# EasyEDA Pro project ProPrj_Ozealis_2025-07-08.epro, board PCB1
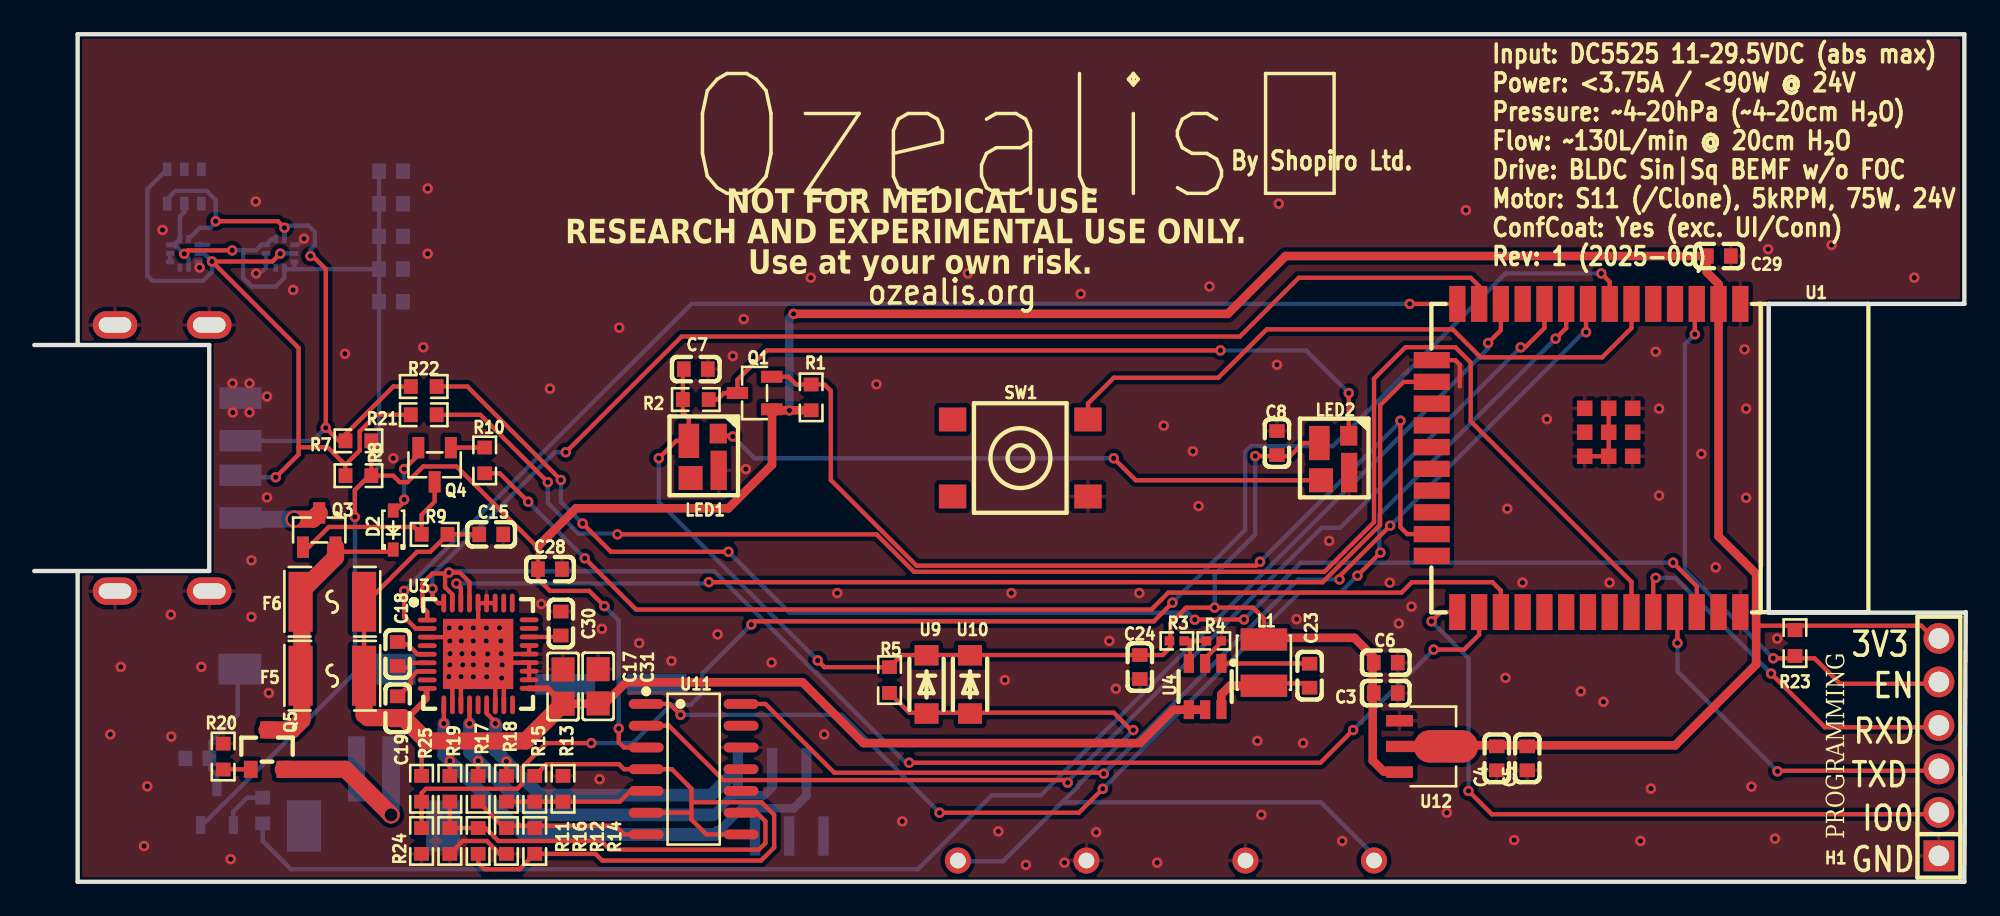
[diagram p1: board, top side]
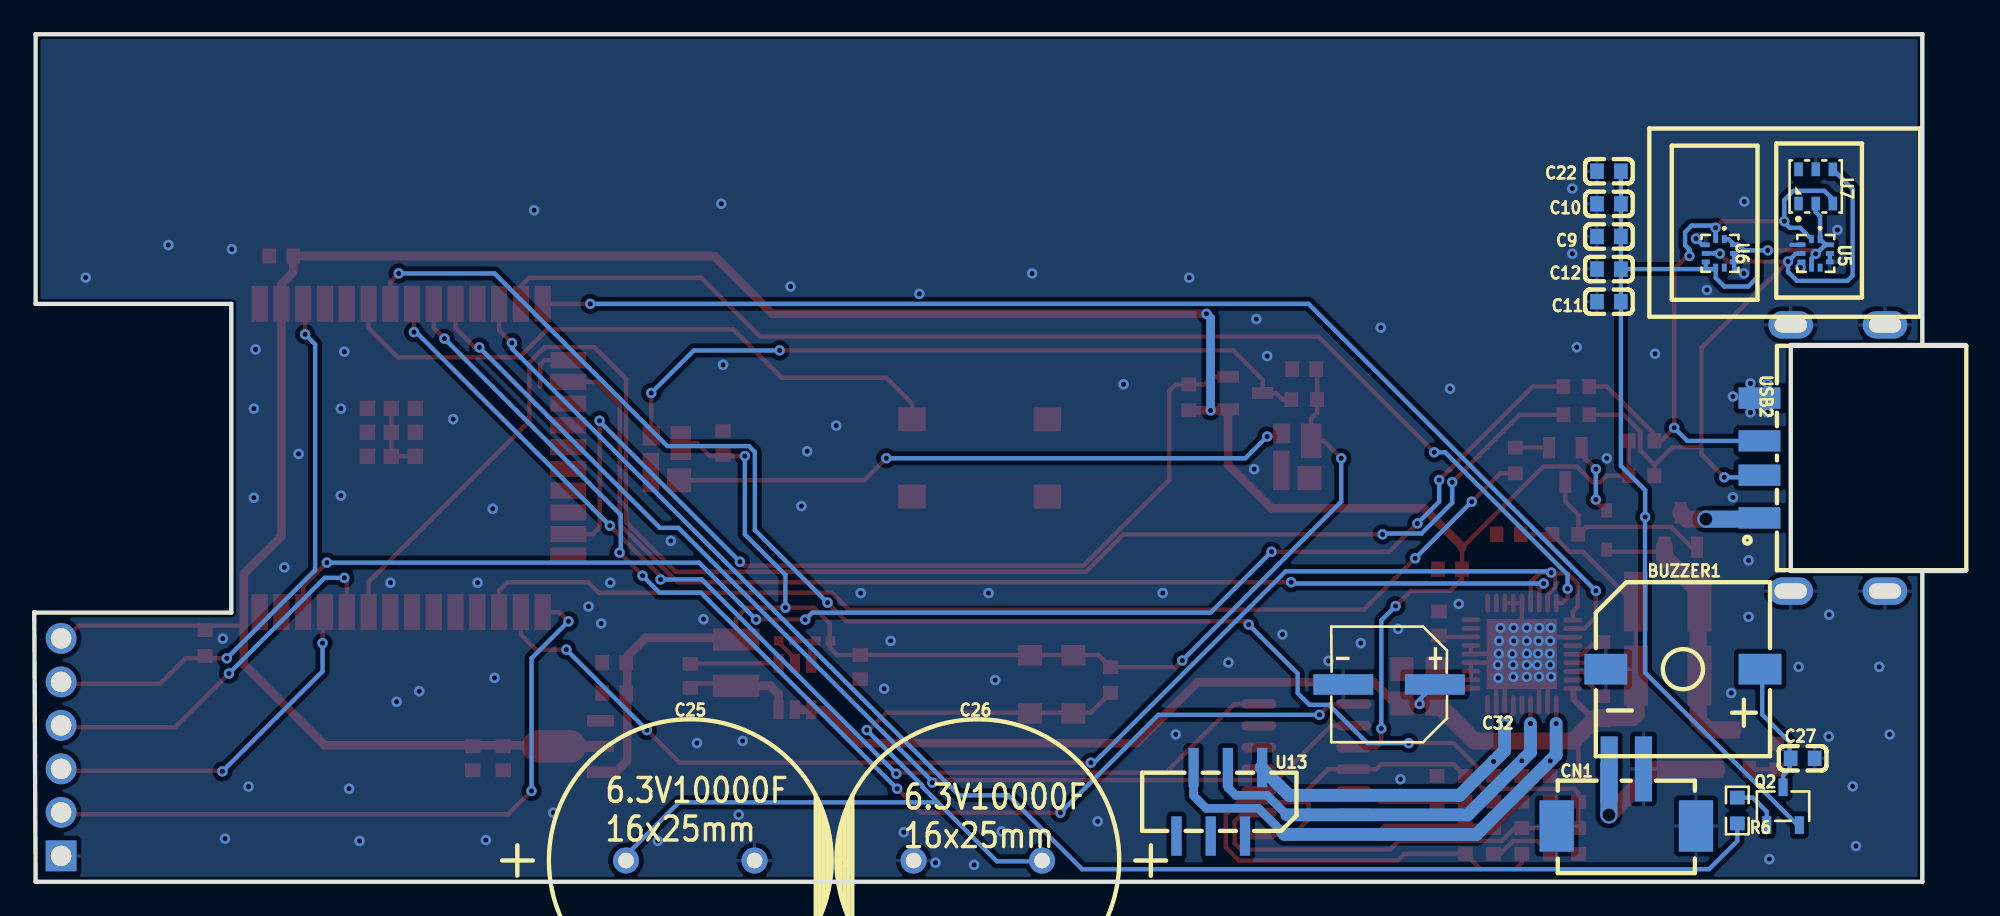
[diagram p2: board, bottom side, seen from below]

Outline 112.7 x 49.5 mm; copper layers: Top Layer, Bottom Layer. Coordinates in mm from the lower left corner of the outline.
Outline path: 2.53,31.38 2.53,49.5 112.62,49.5 112.62,33.75 101.2,33.75 101.2,15.72 112.66,15.72 112.7,15.75 112.62,0 2.53,0 2.53,18.14
Stack: Top Layer 0.035mm / Dielectric1 1.51mm FR4 er 4.5 / Bottom Layer 0.035mm

## Design rules (mm)
template: JLCPCB Capability(Two Layers Board)
spacing copperThickness1oz (default): track to track 0.102, other pairs 0.152 to 0.3
spacing copperThickness2oz: track to track 0.203, other pairs 0.152 to 0.3
track width copperThickness1oz (default): min 0.127, default 0.254, max 2.54
track width copperThickness2oz: min 0.203, default 0.254, max 2.54
differential pair differentialPair (default): width min 0.127, default 0.254, max 2.54; gap min 0.152, default 0.152
via viaSize (default): diameter min 0.5, default 0.61, max 10; hole min 0.3, default 0.305, max 6.3

## Placement (name value [footprint] x y rotation side)
BUZZER1  3kHz  [BUZ-SMD_L9.6-W9.6-LS10.0-R]  16.5 12.42 180 bottom
C3  100nF  [C0603]  78.86 11.02 180 top
C4  100nF  [C0603]  85.34 7.21 270 top
C5  1uF  [C0603]  87.11 7.21 270 top
C6  1uF  [C0603]  78.86 12.8 180 top
C7  100nF  [C0603]  38.6 29.94 0 top
C8  100nF  [C0603]  72.51 25.62 90 top
C9  100nF  [C0603]  20.82 37.69 180 bottom
C10  1uF  [C0603]  20.82 39.59 0 bottom
C11  100nF  [C0603]  20.82 33.88 180 bottom
C12  1uF  [C0603]  20.82 35.78 0 bottom
C15  100nF  [C0603]  26.66 20.29 0 top
C17  10uF  [C0805]  30.85 11.4 270 top
C18  100nF  [C0603]  21.2 13.31 90 top
C19  10nF  [C0603]  21.2 10.13 90 top
C22  100nF  [C0603]  20.82 41.5 0 bottom
C23  100nF  [C0603]  74.41 12.03 270 top
C24  10uF  [C0603]  64.51 12.54 270 top
C25  6.3V10000uF  [PolCap_16x25mm]  74.41 1.24 0 bottom
C26  6.3V10000uF  [PolCap_16x25mm]  57.65 1.24 180 bottom
C27  100nF  [C0603]  9.52 7.21 0 bottom
C28  100nF  [C0603]  30.09 18.26 0 top
C29  1uF  [C0603]  98.29 36.55 0 top
C30  470nF  [C0603]  30.73 15.08 90 top
C31  10uF  [C0805]  32.9 11.42 270 top
C32  100uF  [CAP-SMD_BD6.3-L6.6-W6.6-LS7.4-FD]  33.65 11.53 0 bottom
CN1  HCZZ0469-2  [CONN-SMD_2P-P2.00_HCZZ0469-2]  19.8 4.92 180 bottom
D2  BZT52C10S  [SOD-323_L1.7-W1.3-LS2.6-RD]  20.95 20.54 90 top
F5  SMD1812-200C-30V  [F1812]  17.39 12.03 0 top
F6  SMD1812-200C-30V  [F1812]  17.39 16.35 0 top
H1  2.54-1x6P直针  [HDR-TH_6P-P2.54-V-M-1]  111.13 7.86 90 top
L1  3.3uH  [IND-SMD_L3.0-W3.0_FNR30XXS]  71.75 12.8 270 top
LED1  SK6812MINI-B-012  [LED-SMD_4P-L3.5-W3.5-R-SK6812MINI]  39.06 24.88 90 top
LED2  SK6812MINI-B-012  [LED-SMD_4P-L3.5-W3.5-R-SK6812MINI]  75.85 24.75 90 top
Q1  BSS138  [SOT-23-3_L2.9-W1.3-P1.90-LS2.4-BR-1]  42.03 28.55 0 top
Q2  IRLML6344  [SOT-23-3_L3.0-W1.7-P0.95-LS2.9-BR]  10.66 4.42 270 bottom
Q3  CJ2305  [SOT-23-3_L2.9-W1.3-P1.90-LS2.4-BR]  16.63 20.54 270 top
Q4  MMBT3904(RANGE:100-300)  [SOT-23-3_L2.9-W1.3-P1.90-LS2.4-BR]  23.36 24.35 90 top
Q5  AO3401A  [SOT-23_L2.9-W1.3-P1.90-LS2.4-BR]  13.58 7.72 270 top
R1  10kΩ  [R0603]  45.33 28.29 90 top
R2  10kΩ  [R0603]  38.6 28.16 0 top
R3  118kΩ  [R0402]  66.67 14.07 0 top
R4  22.1kΩ  [R0402]  68.83 14.07 180 top
R5  2.2Ω  [R0603]  49.9 11.78 270 top
R6  10kΩ  [R0603]  13.33 4.16 90 bottom
R7  10kΩ  [R0603]  18.91 25.75 180 top
R8  10kΩ  [R0603]  18.91 23.72 180 top
R9  10kΩ  [R0603]  23.36 20.29 0 top
R10  1kΩ  [R0603]  26.28 24.61 270 top
R11  10kΩ  [R0603]  24.25 2.38 270 top
R12  10kΩ  [R0603]  27.55 2.38 270 top
R13  10kΩ  [R0603]  30.85 5.43 90 top
R14  100kΩ  [R0603]  29.2 2.38 90 top
R15  100kΩ  [R0603]  29.2 5.43 270 top
R16  100kΩ  [R0603]  25.9 2.38 90 top
R17  100kΩ  [R0603]  25.9 5.43 90 top
R18  100kΩ  [R0603]  27.55 5.43 90 top
R19  100kΩ  [R0603]  24.25 5.43 90 top
R20  10kΩ  [R0603]  11.02 7.31 90 top
R21  100Ω  [R0603]  22.72 27.28 180 top
R22  100Ω  [R0603]  22.72 28.93 180 top
R23  10kΩ  [R0603]  102.73 13.94 270 top
R24  10kΩ  [R0603]  22.6 2.38 90 top
R25  100kΩ  [R0603]  22.6 5.43 90 top
SW1  B3FS-1000P  [KEY-SMD_4P-L6.0-W6.3-P4.50-LS8.0]  57.53 24.75 0 top
U1  ESP32-WROOM-32E-N8  [WIFI-SMD_ESP32-WROOM-32E]  90.54 24.75 180 top
U3  DRV8313RHHR  [VQFN-36_L6.0-W6.0-P0.50-TL-EP]  25.9 13.31 0 top
U4  LMR54406DBVR  [SOT-23-6_L2.9-W1.6-P0.95-LS2.8-BR]  68.32 11.4 90 top
U5  LPS22HBTR  [HLGA-10L_LPS22HBTR]  8.75 36.7 270 bottom
U6  LPS22HBTR  [HLGA-10L_LPS22HBTR]  14.34 36.7 270 bottom
U7  AHT20  [SENSOR-SMD_L3.0-W3.0-P1.00-BR]  8.75 40.61 270 bottom
U9  SD103AWL  [SOD-123FL_L2.8-W1.9-LS3.7-RD]  52.06 11.53 270 top
U10  SD103AWL  [SOD-123FL_L2.8-W1.9-LS3.7-RD]  54.6 11.53 270 top
U11  LM339  [SOIC-14_L8.7-W3.9-P1.27-LS6.0-BL]  38.47 6.57 270 top
U12  AMS1117-3.3(XBLW) SOT-89  [SOT-89-3_L4.5-W2.5-P1.50-LS4.2-BR]  81.01 7.9 180 top
U13  AFB10-S06LCA-00  [FPC-SMD_6P-P1.00_AFB10-S6LCA-00]  43.55 4.67 0 bottom
USB2  U-A-24DS-W-1  [USB-A-SMD_U-A-24DS-W-1.]  8.37 24.75 90 bottom

## Footprints (pads in the part's own frame, mm; a bottom-side part is the same pattern mirrored in y, then rotated)
BUZ-SMD_L9.6-W9.6-LS10.0-R
  rect 2.5x1.8 smd: 1(4.5,0) 2(-4.5,0)
C0603
  rect 0.8x0.9 smd: 1(-0.7,0) 2(0.7,0)
C0805
  rect 1.41x1.35 smd: 1(-1,0) 2(1,0)
CAP-SMD_BD6.3-L6.6-W6.6-LS7.4-FD
  rect 3.5x1.2 smd: 1(-2.67,0) 2(2.67,0)
CONN-SMD_2P-P2.00_HCZZ0469-2
  rect 1x3.8 smd: 1(1,1.667) 2(-1,1.667)
  rect 2x3 smd: 3(-4.064,-1.667) 4(4.064,-1.667)
F1812
  rect 1.407x3.499 smd: 1(-1.853,0) 2(1.853,0)
FPC-SMD_6P-P1.00_AFB10-S6LCA-00
  rect 0.6x2.3 smd: 1(-2.5,-2) 2(-1.5,2) 3(-0.5,-2) 4(0.5,2) 5(1.5,-2) 6(2.5,2)
HDR-TH_6P-P2.54-V-M-1
  rect 1.8x1.8 hole 1.2: 1(-6.35,0)
  round 1.8 hole 1.2: 2(-3.81,0) 3(-1.27,0) 4(1.27,0) 5(3.81,0) 6(6.35,0)
HLGA-10L_LPS22HBTR
  rect 0.465x0.28 smd: 1(-0.833,0.255) 2(-0.833,-0.245) 6(0.833,-0.245) 7(0.833,0.255)
  rect 0.28x0.465 smd: 3(-0.5,-0.828) 4(0,-0.828) 5(0.5,-0.828) 8(0.5,0.828) 9(0,0.828) 10(-0.5,0.828)
IND-SMD_L3.0-W3.0_FNR30XXS
  rect 1.3x2.72 smd: 1(1.35,0) 2(-1.35,0)
KEY-SMD_4P-L6.0-W6.3-P4.50-LS8.0
  rect 1.6x1.4 smd: 1(3.95,-2.25) 2(-3.95,-2.25) 3(3.95,2.25) 4(-3.95,2.25)
LED-SMD_4P-L3.5-W3.5-R-SK6812MINI
  rect 1.15x1 smd: 1(1.3,-0.845)
  rect 2x1.2 smd: 2(0.875,0.87)
  rect 1.4x1.4 smd: 3(-1.3,0.77)
  rect 2.3x0.95 smd: 4(-0.85,-0.87)
PolCap_16x25mm
  round 1.524 hole 0.914: 1(3.757,-0.001) 2(-3.743,-0.001)
R0402
  rect 0.566x0.54 smd: 1(-0.433,0) 2(0.433,0)
R0603
  rect 0.806x0.864 smd: 1(-0.753,0) 2(0.753,0)
SENSOR-SMD_L3.0-W3.0-P1.00-BR
  rect 0.8x0.5 smd: 1(1,-1) 2(1,0) 3(1,1) 4(-1,1) 5(-1,0) 6(-1,-1)
SOD-123FL_L2.8-W1.9-LS3.7-RD
  rect 1.2x1.4 smd: 1(-1.7,0) 2(1.7,0)
SOD-323_L1.7-W1.3-LS2.6-RD
  rect 0.83x0.63 smd: 1(-1.14,0) 2(1.14,0)
SOIC-14_L8.7-W3.9-P1.27-LS6.0-BL
  oval 0.574x2.038 smd: 1(-3.81,-2.769) 2(-2.54,-2.769) 3(-1.27,-2.769) 4(0,-2.769) 5(1.27,-2.769) 6(2.54,-2.769) 7(3.81,-2.769) 8(3.81,2.769) 9(2.54,2.769) 10(1.27,2.769) 11(0,2.769) 12(-1.27,2.769) 13(-2.54,2.769) 14(-3.81,2.769)
SOT-23-3_L2.9-W1.3-P1.90-LS2.4-BR
  rect 1.25x0.7 smd: 1(1,-0.95) 2(1,0.95) 3(-1,0)
SOT-23-3_L2.9-W1.3-P1.90-LS2.4-BR-1
  rect 1.25x0.7 smd: 1(1,-0.95) 2(1,0.95) 3(-1,0)
SOT-23-3_L3.0-W1.7-P0.95-LS2.9-BR
  rect 1.038x0.532 smd: 1(1.101,-0.95) 2(1.101,0.95) 3(-1.101,0)
SOT-23-6_L2.9-W1.6-P0.95-LS2.8-BR
  rect 1.1x0.6 smd: 1(1.35,-0.95) 2(1.35,0) 3(1.35,0.95) 4(-1.35,0.95) 5(-1.35,0) 6(-1.35,-0.95)
SOT-23_L2.9-W1.3-P1.90-LS2.4-BR
  rect 1x0.8 smd: 1(1.15,-0.95) 2(1.15,0.95) 3(-1.15,0)
SOT-89-3_L4.5-W2.5-P1.50-LS4.2-BR
  rect 1.575x0.672 smd: 1(1.356,-1.5) 3(1.356,1.5)
  custom 5.377x1.9 smd: 2(-1.356,0)
USB-A-SMD_U-A-24DS-W-1.
  rect 1.25x2.45 smd: 1(-3.5,3.663) 2(-1,3.663) 3(1,3.663) 4(3.5,3.663)
  oval 1.6x2.6 hole 0.9x1.9: 5(-7.775,-3.663) 5(-7.775,1.837) 5(7.775,-3.663) 5(7.775,1.837)
VQFN-36_L6.0-W6.0-P0.50-TL-EP
  oval 1.1x0.28 smd: 1(-2.972,1.981) 2(-2.972,1.484) 3(-2.972,0.983) 4(-2.972,0.482) 5(-2.972,-0.018) 6(-2.972,-0.518) 7(-2.972,-1.018) 8(-2.972,-1.519) 9(-2.972,-2.017) 19(2.972,-2.006) 20(2.972,-1.509) 21(2.972,-1.008) 22(2.972,-0.508) 23(2.972,-0.007) 24(2.972,0.493) 25(2.972,0.993) 26(2.972,1.494) 27(2.972,1.992)
  oval 0.28x1.1 smd: 10(-2.002,-2.972) 11(-1.504,-2.972) 12(-1.004,-2.972) 13(-0.503,-2.972) 14(-0.003,-2.972) 15(0.498,-2.972) 16(0.998,-2.972) 17(1.498,-2.972) 18(2.006,-2.972) 28(1.992,2.972) 29(1.494,2.972) 30(0.993,2.972) 31(0.493,2.972) 32(-0.007,2.972) 33(-0.508,2.972) 34(-1.008,2.972) 35(-1.509,2.972) 36(-2.006,2.972)
  rect 4.1x4.1 smd: 37(0,0)
WIFI-SMD_ESP32-WROOM-32E
  rect 0.95x2.1 smd: 1(-9.002,-9) 2(-7.732,-9) 3(-6.463,-9) 4(-5.192,-9) 5(-3.922,-9) 6(-2.652,-9) 7(-1.383,-9) 8(-0.113,-9) 9(1.157,-9) 10(2.428,-9) 11(3.697,-9) 12(4.968,-9) 13(6.237,-9) 14(7.508,-9) 25(7.508,9) 26(6.237,9) 27(4.968,9) 28(3.697,9) 29(2.428,9) 30(1.157,9) 31(-0.113,9) 32(-1.383,9) 33(-2.652,9) 34(-3.922,9) 35(-5.192,9) 36(-6.463,9) 37(-7.732,9) 38(-9.002,9)
  rect 2.1x0.95 smd: 15(9.002,-5.715) 16(9.002,-4.445) 17(9.002,-3.175) 18(9.002,-1.905) 19(9.002,-0.635) 20(9.002,0.635) 21(9.002,1.905) 22(9.002,3.175) 23(9.002,4.445) 24(9.002,5.715)
  rect 0.9x0.9 smd: 39(-2.721,-0.1) 39(-2.721,-1.5) 39(-2.721,-2.9) 39(-1.321,-0.1) 39(-1.321,-1.5) 39(-1.321,-2.9) 39(0.079,-0.1) 39(0.079,-1.5) 39(0.079,-2.9)

## Nets
As in the schematic.

Pads without a net: LED1 3; SW1 2 4; U1 4 5 11 17 18 19 20 21 22 24 28 29 30 31 32 37; U3 4 8 14 18 26 27 28 29; U5 7; U6 7; U7 1 6; U11 10 11 13; U13 2 4 6

## Via types
v1: diameter 0.61, hole 0.305, Top Layer to Bottom Layer, 202 vias
v2: diameter 1, hole 0.75, Top Layer to Bottom Layer, 2 vias

## Routing (per net, layer and track width the routed paths; a pad name or vN(x,y) marks a point on that pad's centre or on a via; arc(x,y) is an arc through that point)
3V3: length 235.2
  Top Layer w0.254: 100.47,15.04 100.55,14.96 110.1,14.96 110.96,14.1 ; v1(18.71,21.31) 18.71,22.88 19.55,23.72 R8.1 ; R8.1 R7.1 ; R8.1 20.95,23.72 21.33,23.34 21.77,23.34 22.69,24.26 24.64,24.26 29.39,19.51 C28.1 29.39,17.69 30.09,16.99 32.38,16.99 v1(33.27,16.1) ; U11.3 34.41,7.84 34.1,8.15 v1(34.1,8.95) ; v1(8.75,36.67) 8.96,36.88 v1(11.55,36.88)
  Top Layer w0.5: R1.1 43.3,27.54 43.04,27.28 43.04,24.35 40.5,21.81 31.61,21.81 29.39,19.59 29.39,19.51 ; 82.17,7.97 95.75,7.97 100.47,12.69 100.47,17.98 98.27,20.18 U1.2 98.27,34.91 97.59,35.59 C29.1 73.02,36.55 69.64,33.17 v1(44.3,33.17)
  Bottom Layer w0.254: U6.5 15.17,35.79 15.16,35.78 ; C12.1 C11.2 20.12,24.29 18.71,22.88 v1(18.71,21.31) 18.71,21.3 18.71,12.22 9.77,3.27 9.6,3.27 ; C12.1 15.52,35.78 15.52,35.78 15.16,35.78 ; C12.1 C9.2 C10.1 C22.1 ; v1(33.27,16.1) 34.1,15.26 v1(34.1,8.95) ; 8.71,36.69 9,36.39 U5.6 ; 8.71,36.69 8.27,37.12 8.25,37.12 8.17,37.2 ; 8.71,36.69 8.74,36.69 v1(8.75,36.67) ; 15.16,35.78 14.82,35.78 14.82,35.78 14.67,35.78 U6.6 14.59,35.27 14.09,34.77 12.69,34.77 12.18,35.28 12.18,36.88 ; 8.17,37.2 U5.1 8.5,38.86 8.75,39.12 U7.2 ; 8.17,37.2 U5.10 ; v1(11.55,36.88) 12.18,36.88 ; 12.18,36.88 12.92,36.88 13.25,37.2 U6.10 13.85,37.53 U6.1
  Bottom Layer w0.5: v1(44.06,27.53) 44.06,32.93 v1(44.3,33.17)
5V: length 81
  Top Layer w0.254: 71.75,14.15 71.75,15.38 71.11,16.01 v1(68.87,16.01) 67.21,16.01 67.17,15.97 ; v1(36.44,24.73) 37.46,25.75 LED1.2 38.19,27.05 37.85,27.39 37.85,27.94 ; v1(71.24,24.86) 73.27,24.86 74.03,25.62 LED2.2 ; 67.17,15.97 67.15,15.97 ; 67.17,15.97 66.28,15.08 66.28,13.69 65.84,13.24 C24.1 50.61,13.24 R5.1 46.1,12.53 v1(45.71,12.92) ; C7.1 37.85,29.89 R2.1
  Top Layer w0.5: 80.12,6.45 78.73,6.45 78.1,7.08 78.1,13.18 77.03,14.25 71.85,14.25 71.75,14.15
  Bottom Layer w0.254: v1(71.24,24.86) 71.24,20.29 68.87,17.92 v1(68.87,16.01) ; v1(45.71,12.92) 36.44,22.19 v1(36.44,24.73)
GND: length 38
  Top Layer w0.254: U3.37 v1(26.46,13.31) 28.36,13.31 ; U3.37 25.9,16.27 U3.32 U3.31 U3.30 ; U3.37 26.41,12.8 28.87,12.8 U3.21 U3.20 ; U3.37 24.92,14.29 U3.3 ; 24.4,11.67 24.4,11.77 v1(24.19,11.98) ; 24.4,11.67 24.9,12.17 24.9,10.33 ; 24.4,11.67 24.4,10.33 ; R11.2 25,2.38 26.41,2.38 27.16,1.63 R12.2 ; 83.18,28.93 83.18,30.2 82.91,30.47 U1.15 ; U1.39 U1.39 U1.39 U1.39 ; 26.9,12.31 26.9,10.33 ; U3.24 U3.23 ; 27.4,11.81 27.4,10.33 ; R4.1 69.26,13.99 68.32,13.04 U4.2
  Bottom Layer w0.254: U6.9 U6.8 13.51,35.85 13.33,35.66 ; v1(15.74,37.56) 15.38,37.2 U6.3 ; U5.9 U5.8 ; U5.3 10.17,37.2
  vias: v1(4.44,8.61) v1(5.05,12.55) v1(6.41,2.09) v1(6.59,5.57) v1(7.48,38.07) v1(7.97,15.6) v1(7.99,8.48) v1(9.65,35.87) v1(9.75,12.55) v1(11.46,1.32) v1(11.57,29.1) v1(11.58,27.41) v1(12.56,29.11) v1(12.56,27.41) v1(12.67,18.77) v1(12.67,15.47) v1(12.92,39.73) v1(12.95,35.53) v1(13.58,28.34) v1(13.58,22.45) v1(13.68,11.03) v1(15.1,34.56) v1(18.13,30.84) v1(20.95,24.73) v1(22.7,31.22) v1(22.96,40.49) v1(22.96,36.68) v1(24.21,14.83) v1(24.25,14.07) v1(24.26,13.32) v1(24.25,12.67) v1(24.88,14.83) v1(24.92,14.07) v1(24.96,13.32) v1(24.9,11.98) v1(25,12.67) v1(25.62,14.83) v1(25.62,14.07) v1(25.62,13.32) v1(25.62,12.67) v1(25.62,11.97) v1(26.38,14.83) v1(26.37,14.07) v1(26.41,12.67) v1(26.39,11.97) v1(27.15,14.83) v1(27.23,14.07) v1(27.24,13.32) v1(27.27,11.9) v1(27.3,12.67) v1(29.58,16.23) v1(30.09,28.8) v1(32.98,5.99) v1(33.12,14.77) v1(34.13,32.36) v1(35.3,13.94) v1(37.18,12.9) v1(39.87,14.45) v1(40.76,30.7) v1(41.39,32.86) v1(41.52,24.1) v1(43.02,12.8) v1(45.31,35.28) v1(46.09,8.61) v1(46.85,16.86) v1(49.14,29.05) v1(50.65,3.53) v1(54.47,35.53) v1(56.25,2.94) v1(56.63,11.78) v1(57.01,16.86) v1(57.86,0.99) v1(60.11,1.11) v1(61.06,34.34) v1(61.96,2.89) v1(62.73,14.07) v1(63.11,11.27) v1(64.48,16.86) v1(65.52,1.11) v1(65.9,26.64) v1(67.6,25.14) v1(67.94,21.94) v1(68.57,34.77) v1(71.37,8.22) v1(71.6,3.91) v1(72.51,30.2) v1(72.61,39.6) v1(73.65,15.34) v1(74.03,8.1) v1(75.56,19.91) v1(76.32,2.38) v1(79.09,17.47) v1(79.62,15.08) v1(80.36,16.07) v1(82.41,4.03) v1(83.53,39.22) v1(85.84,11.91) v1(85.95,21.79) v1(86.35,2.44) v1(86.84,17.47) v1(88.26,27.02) v1(90.23,11.12) v1(91.56,10.51) v1(91.92,17.47) v1(93.72,2.38) v1(94.33,5.44) v1(94.61,30.96) v1(94.81,27.63) v1(94.81,22.55) v1(97.27,24.99) v1(98.11,18.36) v1(99.79,31.09) v1(99.89,27.63) v1(99.89,22.43) v1(100.19,5.56) v1(101.17,36.95) v1(101.57,2.52) v1(101.69,14.2) v1(104.87,37.19) v1(109.7,35.28)
VIN: length 10.3
  Top Layer w1: Q5.2 18.16,6.57 v2(20.82,3.91)
  Bottom Layer w1: v2(20.82,3.91) 20.82,6.83 20.8,6.84
VIN_F: length 76.8
  Top Layer w0.254: R25.2 22.6,7.93 22.89,8.22 ; C15.1 R9.2 24.11,20.28 23.11,19.27 22.34,19.27 19.24,16.17 F5.2
  Top Layer w0.35: 21.98,9.14 21.98,9.76 22.89,10.67 22.89,11.25 ; C17.2 29.95,11.3 U3.19
  Top Layer w0.5: C17.2 33.28,10.4 34.54,11.65 44.82,11.65 48.38,8.1 64.51,8.1 66.46,10.05 U4.4 U4.5
  Top Layer w1: C17.2 28.68,8.22 22.89,8.22 21.53,9.58 19.46,9.58 19.27,9.78 19.24,9.75 F5.2
  Bottom Layer w0.254: C32.1 31.87,10.64 v1(31.87,10.38)
VIN_REV_PROT: length 16.7
  Top Layer w0.254: Q3.2 17.84,19.28 20.95,19.28
  Top Layer w1: 15.61,9.67 15.61,16.99 17.58,18.95 Q3.2 ; 15.61,9.67 15.61,9.45 15.03,8.87 Q5.3 ; 15.61,9.67 15.66,9.62
VIN_SEN: length 89.3
  Top Layer w0.254: v1(91.43,35.53) 91.92,35.04 U1.7 ; v1(66.41,16.3) 65.32,15.21 42.03,15.21 v1(41.84,15.02) ; v1(32.5,8.1) 29.89,8.1 28.49,6.7 28.49,5.74 28.19,5.43 22.85,5.43 22.6,5.18 R25.1 R24.2
  Bottom Layer w0.254: v1(41.84,15.02) 38.98,12.16 38.98,11.02 38.29,10.33 37.15,10.33 34.92,8.1 v1(32.5,8.1) ; v1(91.43,35.53) 85.84,35.53 75.76,25.45 71,25.45 70.65,25.1 70.65,20.54 v1(66.41,16.3)
ACC_EN: length 64.7
  Top Layer w0.254: v1(32.12,18.89) 35.12,15.9 65.18,15.9 66.17,16.89 79.77,16.89 80.38,17.5 85.08,17.5 85.57,17 U1.27 ; R10.2 27.16,23.85 v1(28.82,22.19)
  Bottom Layer w0.254: v1(32.12,18.89) v1(28.82,22.19)
BTN_SIG: length 37.2
  Top Layer w0.254: SW1.3 61.48,27.93 62.98,29.44 69.08,29.44 71.91,32.26 82.76,32.26 84.4,30.63 91.48,30.63 93.19,32.34 U1.6
BZR_SIG: length 88.7
  Top Layer w0.254: v1(84.83,31.47) 85.57,32.21 U1.12
  Bottom Layer w0.254: v1(84.83,31.47) 84.83,31.14 58.73,5.05 55.87,5.05 51.55,0.73 14.98,0.73 13.33,2.38 R6.1
EN: length 33.2
  Top Layer w0.254: v1(96.89,31.97) 96.89,33.64 U1.3 ; 110.96,11.56 105.36,11.56 103.88,13.05 v1(101.46,13.05)
  Bottom Layer w0.254: v1(101.46,13.05) 96.31,18.21 96.31,31.39 v1(96.89,31.97)
IIC_SCL: length 38.4
  Top Layer w0.254: v1(16.12,36.55) 16.25,36.55 17.01,35.78 v1(17.01,26.51) 17.77,25.75 R7.2 18.16,26.14 20.95,28.93 R22.2 ; v1(14.6,38.2) 14.22,38.58 v1(10.58,38.58)
  Bottom Layer w0.254: U7.3 7.78,39.61 7.87,39.7 7.87,39.97 8.25,40.36 10.05,40.36 10.58,39.82 10.58,38.5 10.28,38.2 9.66,38.2 U5.2 ; 14.6,38.17 14.75,38.32 15.99,38.32 16.37,37.94 16.37,37.18 16.12,36.93 v1(16.12,36.55) ; 14.6,38.17 14.6,37.54 U6.2 14.59,38.16 14.6,38.17 ; 14.6,38.17 v1(14.6,38.2) ; v1(17.01,26.51) 16.25,25.75 USB2.3
IIC_SDA: length 44.2
  Top Layer w0.254: 15.42,25.37 15.42,31.17 10.37,36.23 13.9,36.23 v1(14.35,36.68) ; 15.42,25.37 17.12,25.37 18.15,24.35 ; 15.42,25.37 15.42,24.96 v1(14.09,23.62) ; R8.2 18.15,23.73 18.15,24.35 ; 18.15,24.35 18.98,25.19 18.98,26.3 19.96,27.28 R21.2
  Bottom Layer w0.254: U6.4 14.37,36.7 v1(14.35,36.68) ; v1(14.09,23.62) 12.16,23.62 USB2.2 ; U7.4 6.59,40.45 6.59,35.4 6.9,35.1 9.84,35.1 10.37,35.62 v1(10.37,36.23) 9.92,36.67 9.75,36.67 9.72,36.7 U5.4
IO0: length 40.4
  Top Layer w0.254: v1(81.53,15.21) 82.06,15.75 U1.25 ; v1(83.68,5.3) 85.04,3.94 110.96,3.94
  Bottom Layer w0.254: v1(83.68,5.3) 83.68,13.05 v1(81.53,15.21)
LED_SIG: length 56
  Top Layer w0.254: v1(79.72,26.93) 79.72,20.7 80.11,20.31 U1.23 ; v1(71.52,18.69) 71.29,18.46 51.48,18.46 46.47,23.47 46.47,28.67 46.1,29.04 R1.2 44.45,29.04 44,29.5 Q1.2
  Bottom Layer w0.254: v1(71.52,18.69) 79.72,26.89 v1(79.72,26.93)
MOT_EN: length 77.9
  Top Layer w0.254: U3.33 25.39,17.5 24.83,18.06 v1(24.19,18.06) 23.98,17.85 23.97,17.85 ; U1.26 84.3,14.43 83.43,13.56 v1(81.65,13.56) ; v1(76.95,8.86) 75.05,6.95 v1(51.05,6.95) ; 23.97,17.85 23.97,18 23.23,18 22.65,17.42 22.65,16.05 22.93,15.77 U3.1 ; 23.97,17.85 23.97,17.2 24.39,16.78 U3.35
  Bottom Layer w0.254: v1(24.19,18.06) 24.26,18.13 39.68,18.13 50.85,6.95 v1(51.05,6.95) ; v1(76.95,8.86) v1(81.65,13.56)
MOT_SEN_U: length 23.5
  Top Layer w0.254: U11.9 42.16,4.03 42.66,3.53 42.66,2.26 42.28,1.88 33.59,1.88 33.08,2.38 27.07,2.38 26.32,3.14 R16.2 R11.1 R19.1
MOT_SEN_U_DIG: length 63.5
  Top Layer w0.254: v1(79.11,20.8) 76.16,17.84 v1(76.16,17.66) ; v1(62.4,6.31) 62.34,6.37 46.68,6.37 42.66,10.38 U11.14 ; U1.8 90.54,33.64 v1(90.54,32.1)
  Bottom Layer w0.254: v1(62.4,6.31) 73.75,17.66 v1(76.16,17.66) ; v1(90.54,32.1) 90.41,32.1 v1(79.11,20.8)
MOT_SEN_V: length 10.6
  Top Layer w0.254: U11.7 34.41,2.76 33.9,3.27 27.3,3.27 R17.1
MOT_SEN_V_DIG: length 70.8
  Top Layer w0.254: v1(88.76,31.72) 89.38,32.34 U1.9 ; v1(77.21,17.88) 77.21,17.88 v1(78.55,19.22) ; U11.1 37.08,10.38 v1(37.71,9.75) ; v1(52.82,4.03) 60.95,4.03 v1(62.35,5.43)
  Bottom Layer w0.254: v1(88.76,31.72) 78.48,21.43 78.48,19.29 v1(78.55,19.22) ; v1(62.35,5.43) 73.8,16.89 76.22,16.89 v1(77.21,17.88) ; v1(37.71,9.75) 47.11,9.75 v1(52.82,4.03)
MOT_SEN_VIRT: length 43.6
  Top Layer w0.254: R15.1 29.88,6.87 34.12,6.87 34.41,6.57 U11.4 37.2,6.57 38.34,5.43 38.34,4.64 ; R16.1 25.9,1.11 26.28,0.73 28.3,0.73 R14.1 32.75,1.63 33.14,1.24 42.41,1.24 43.17,2 43.17,3.91 42.43,4.64 38.34,4.64 ; U11.8 39.22,2.76 38.34,3.63 38.34,3.99 ; 38.34,4.64 38.34,3.99 ; 38.34,3.99 38.3,4.03 U11.6
MOT_SEN_W: length 8.4
  Top Layer w0.254: U11.5 34.79,5.3 34.16,4.68 R13.1 R15.2 R18.1
MOT_SEN_W_DIG: length 66.2
  Top Layer w0.254: U11.2 37.03,9.11 40.21,5.94 60.14,5.94 v1(60.3,5.79) ; v1(86.73,31.21) 86.99,31.21 88.11,32.34 U1.10
  Bottom Layer w0.254: v1(86.73,31.21) 76.19,20.67 75.11,20.67 60.3,5.86 v1(60.3,5.79)
MOT_SIG_U: length 71.5
  Top Layer w0.254: U3.2 22.26,14.79 21.58,15.46 v1(21.58,16.99) ; U1.14 80.26,33.75 v1(80.25,33.75)
  Bottom Layer w0.254: v1(80.25,33.75) 38.34,33.75 v1(21.58,16.99)
MOT_SIG_V: length 71.6
  Top Layer w0.254: U1.13 84.3,34.78 83.81,35.28 73.78,35.28 70.35,31.85 37.77,31.85 v1(31.01,25.08) ; v1(23.23,17.11) 23.23,16.61 23.56,16.28 U3.36
  Bottom Layer w0.254: v1(31.01,25.08) 30.38,25.08 23.23,17.94 v1(23.23,17.11)
MOT_SIG_W: length 67.1
  Top Layer w0.254: v1(39.36,17.5) 75.17,17.5 78.53,20.85 78.53,27.83 79.89,29.19 U1.16 ; U3.34 24.89,17.16 v1(24.63,17.42)
  Bottom Layer w0.254: v1(24.63,17.42) 39.29,17.42 v1(39.36,17.5)
MOT_U: length 29.5
  Top Layer w0.254: v1(24.25,7.06) R19.2 ; 23.9,10.33 v1(23.9,9.24)
  Bottom Layer w0.5: 39.87,2.89 41.27,4.29 44.31,4.29 45.05,5.03 U13.5
  Bottom Layer w0.75: v1(23.9,9.24) 23.9,7.41 v1(24.25,7.06) 28.55,2.76 39.74,2.76 39.87,2.89
MOT_V: length 24.8
  Top Layer w0.254: 25.4,10.33 v1(25.4,9.24) ; v1(25.9,7.06) R17.2
  Bottom Layer w0.5: 39.62,3.91 40.76,5.05 42.6,5.05 43.05,5.51 43.05,6.8
  Bottom Layer w0.75: 39.62,3.91 29.05,3.91 v1(25.9,7.06) 25.4,7.56 v1(25.4,9.24)
MOT_W: length 19.7
  Top Layer w0.254: 26.4,10.33 26.4,9.83 26.91,9.32 v1(26.91,9.24) ; v1(27.55,7.03) R18.2
  Bottom Layer w0.75: 41.11,6.67 39.49,5.05 29.53,5.05 v1(27.55,7.03) 27.23,7.35 27.22,7.35 26.91,7.67 v1(26.91,9.24)
RXD: length 22
  Top Layer w0.254: 110.96,9.02 104.48,9.02 v1(101.34,12.16) ; v1(94.61,17.75) 94.46,17.61 U1.34
  Bottom Layer w0.254: v1(101.34,12.16) 95.75,17.75 v1(94.61,17.75)
TXD: length 21
  Top Layer w0.254: v1(95.88,13.94) 95.88,15.61 U1.35 ; v1(101.72,6.45) 101.75,6.48 110.96,6.48
  Bottom Layer w0.254: v1(95.88,13.94) 95.88,12.29 v1(101.72,6.45)
$1N3010: length 42.5
  Top Layer w0.254: LED2.1 76.7,27.53 76.7,27.53 v1(76.7,28.55) ; v1(69.21,31.03) 42.74,31.03 41.03,29.32 Q1.3 40.25,28.55 39.87,28.16 R2.2
  Bottom Layer w0.254: v1(76.7,28.55) 74.21,31.03 v1(69.21,31.03)
$1N3107: length 36.1
  Top Layer w0.254: 40.04,26.05 40.71,26.05 v1(40.76,26) ; LED2.3 64.27,23.45 v1(62.98,24.73)
  Bottom Layer w0.254: v1(62.98,24.73) 42.03,24.73 v1(40.76,26)
$1N4556: length 2.2
  Top Layer w0.254: U3.5 22.36,13.29 21.77,13.88 20.95,13.88
$1N4560: length 2
  Top Layer w0.254: U3.6 22.08,12.79 21.8,12.51 21.07,12.51
$1N4648: length 2.7
  Top Layer w0.254: 21.07,10.67 21.96,11.56 21.96,11.91 22.34,12.29 U3.7
$1N5984: length 1.9
  Top Layer w0.254: U3.25 30.64,14.3 C30.1
$1N6530: length 2.5
  Top Layer w0.254: 68.52,14.07 68.52,14.07 67.43,14.07 67.43,12.8 67.37,12.73
$1N6654: length 5.1
  Top Layer w0.254: U4.1 74.05,12.75 74.29,12.99
$1N6821: length 6.1
  Top Layer w0.254: L1.1 71.89,11.59 74.29,11.59
  Top Layer w0.5: 71.62,11.45 69.76,11.45 69.27,10.95 U4.6
$1N7425: length 48.5
  Top Layer w0.254: R5.2 51.05,9.88 62.98,9.88 64,8.86 v1(64.13,8.86)
  Bottom Layer w0.254: 59.97,4.64 75.08,4.64 78.48,1.23 ; 59.97,4.64 60.88,5.55 60.88,5.62 64.12,8.86 ; 59.97,4.64 56.53,1.19 53.94,1.19 C26.1
$1N7619: length 7.7
  Bottom Layer w0.254: Q2.3 10.66,6.19 10.28,6.57 10.28,8.17 11.87,9.77 11.87,12.42
$1N7703: length 2.5
  Bottom Layer w0.254: 11.61,3.62 11.61,4.09 12.43,4.91 R6.2
$1N9249: length 4.8
  Top Layer w1: v2(15.16,21.18) 16.26,21.18 Q3.3
  Bottom Layer w1: USB2.1 12.16,21.25 12.23,21.18 v2(15.16,21.18)
$1N11310: length 2
  Top Layer w0.254: R10.1 24.32,25.36 Q4.1
$1N11461: length 10.9
  Top Layer w0.254: Q4.3 23.36,22.19 22.6,21.43 22.6,20.55 22.47,20.43 ; 22.47,20.43 22.46,20.43 22.17,20.72 17.19,20.72 16.01,19.54 15.68,19.54 ; 22.47,20.43 R9.1
$1N21787: length 1.7
  Top Layer w0.254: 11.02,6.69 11.14,6.57 Q5.1
$1N22073: length 4.4
  Top Layer w0.254: v1(21.58,22.32) 21.58,22.19 20.95,21.56 ; Q4.2 22.41,24.93 v1(21.58,24.1)
  Bottom Layer w0.254: v1(21.58,24.1) v1(21.58,22.32)
$1N24692: length 94
  Top Layer w0.254: R21.1 26.03,27.28 v1(29.96,23.34) ; v1(34.03,20.29) 49.14,20.29 51.33,18.11 75.28,18.11 78.17,21 78.17,29.38 80.01,31.22 82.91,31.22 83.81,30.32 83.81,26.89 93.19,17.51 U1.33
  Bottom Layer w0.254: v1(29.96,23.34) 29.96,22.13 31.75,20.34 33.98,20.34 v1(34.03,20.29)
$1N24734: length 83.4
  Top Layer w0.254: v1(67.71,15.31) 67.72,15.32 v1(70.58,15.32) ; v1(95.62,18.64) 97,17.26 U1.36 ; v1(32,20.92) 33.65,19.27 v1(40.5,19.27) ; v1(30.73,23.47) 25.26,28.93 R22.1
  Bottom Layer w0.254: v1(30.73,23.47) 30.73,22.19 v1(32,20.92) ; v1(70.58,15.32) 73.91,18.64 v1(95.62,18.64) ; v1(67.71,15.31) 67.3,15.72 44.06,15.72 v1(40.5,19.27)

## Copper pours and planes (outline as drawn; the poured copper is in the pictures)
GND on Top Layer: -0.01,51.91 116.83,51.91 116.83,-3.59 -0.01,-3.59
GND on Bottom Layer: 1.26,53.82 120.01,53.82 120.01,-0.79 1.26,-0.79

## Text on the board
Bottom Silkscreen Layer: 6.3V10000F / 16x25mm
Top Silkscreen Layer: By Shopiro Ltd. | ozealis.org | 3V3 | TXD | GND | RXD | IO0 | EN | RESEARCH AND EXPERIMENTAL USE ONLY. | NOT FOR MEDICAL USE | Use at your own risk. | Input: DC5525 11–29.5 VDC (abs max) / Power: <3.75 A / <90 W @ 24 V / Pressure: ~4–20 hPa (~4–20 cm H₂O) / Flow: ~130 L/min @ 20 cm H₂O / Drive: BLDC Sin|Sq BEMF w/o FOC / Motor: S11 (/Clone), 5kRPM, 75W, 24V / ConfCoat: Yes (exc. UI/Conn) / Rev: 1 (2025-06) | PROGRAMMING | Ozealis™
